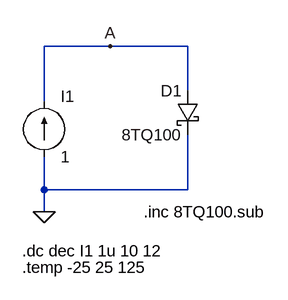
[diagram p0: schematic 8TQ100_Test.asc]
8TQ100_Test.asc, the LTspice schematic file:
Version 4
SHEET 1 880 680
WIRE 64 80 -32 80
WIRE 176 80 64 80
WIRE 176 144 176 80
WIRE -32 160 -32 80
WIRE -32 288 -32 240
WIRE 176 288 176 208
WIRE 176 288 -32 288
WIRE -32 320 -32 288
FLAG -32 320 0
FLAG 64 80 A
SYMBOL schottky 192 144 M0
SYMATTR InstName D1
SYMATTR Value 8TQ100
SYMATTR Prefix X
SYMBOL current -32 240 M180
WINDOW 0 24 88 Left 0
WINDOW 3 24 0 Left 0
SYMATTR InstName I1
SYMATTR Value 1
TEXT -64 376 Left 0 !.dc dec I1 1u 10 12
TEXT 112 320 Left 0 !.inc 8TQ100.sub
TEXT -64 400 Left 0 !.temp -25 25 125

The netlist it stands for:
* 8TQ100_Test.asc
XD1 A 0 8TQ100  ; pins + -
I1 0 A 1
.dc dec I1 1u 10 12
.inc 8TQ100.sub
.temp -25 25 125
.backanno
.end